# EAGLE design WindPower_HAT_E (EAGLE 9.5.0)
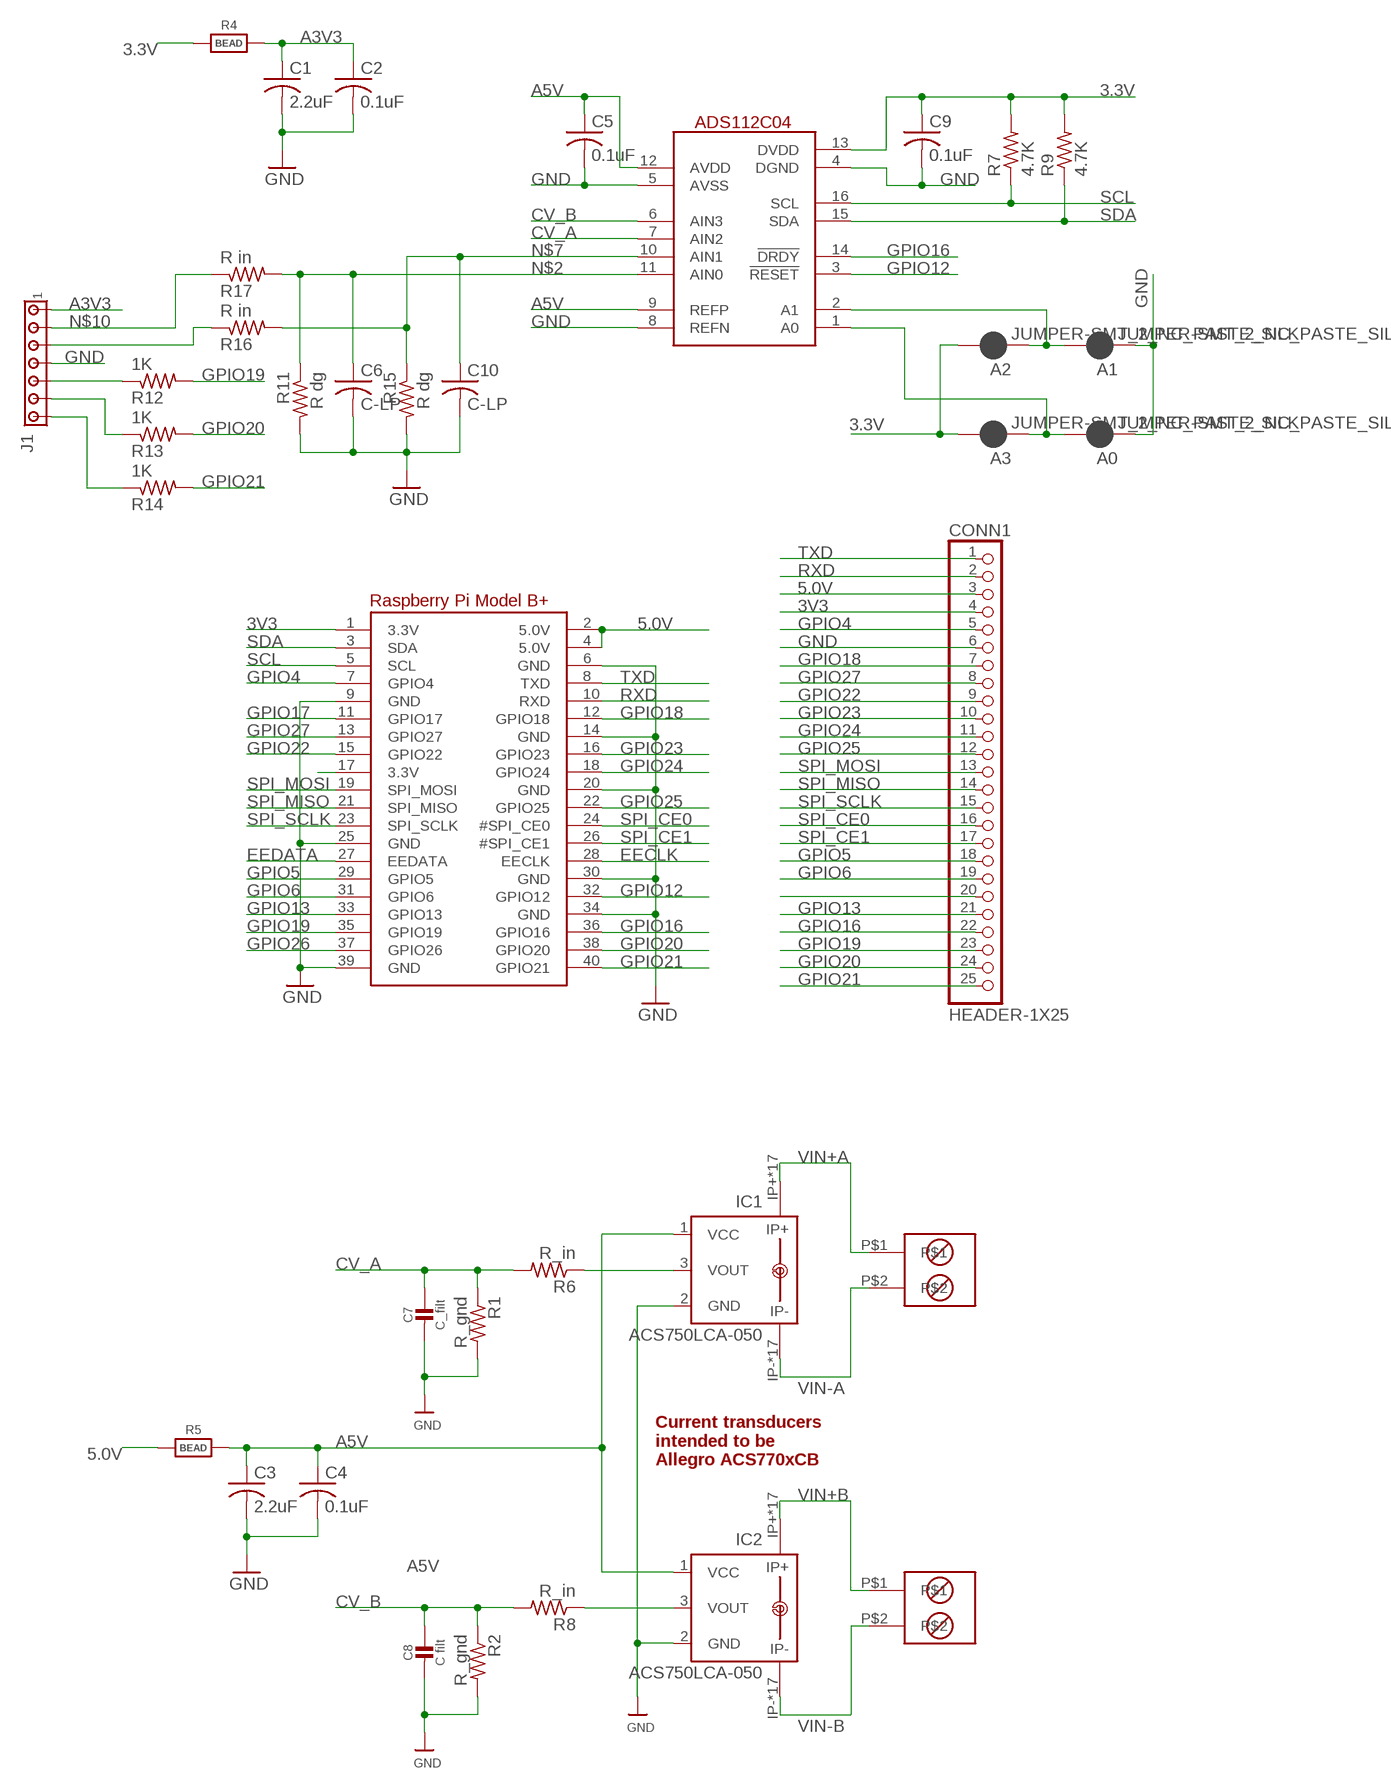
[diagram p0: schematic, sheet 1]

## Parts
A0  JUMPER-SMT_2_NC_PASTE_SILK  [SMT-JUMPER_2_NC_PASTE_SILK]
A1  JUMPER-SMT_2_NC_PASTE_SILK  [SMT-JUMPER_2_NC_PASTE_SILK]
A2  JUMPER-SMT_2_NC_PASTE_SILK  [SMT-JUMPER_2_NC_PASTE_SILK]
A3  JUMPER-SMT_2_NC_PASTE_SILK  [SMT-JUMPER_2_NC_PASTE_SILK]
ADS112C04  ADS112C04TSSOP_FOR_TI_ADC  [SOP65P640X120-16N]
C1  2.2uF  C-USC0805  [C0805]
C2  0.1uF  C-USC0805  [C0805]
C3  2.2uF  C-USC0805  [C0805]
C4  0.1uF  C-USC0805  [C0805]
C5  0.1uF  C-USC0805  [C0805]
C6  C-LP  C-USC0805  [C0805]
C7  C_filt  CAP_CERAMIC0805-NOOUTLINE  [0805-NO@1]
C8  C filt  CAP_CERAMIC0805-NOOUTLINE  [0805-NO@1]
C9  0.1uF  C-USC0805  [C0805]
C10  C-LP  C-USC0805  [C0805]
CONN1  HEADER-1X25  [1X25_ROUND_70MIL]
IC1  ACS750LCA-050  [ACS75050]
IC2  ACS750LCA-050  [ACS75050]
J1  MTA07-100  [10X07MTA]
R1  R_gnd  R-US_R0805  [R0805]
R2  R_gnd  R-US_R0805  [R0805]
R4  BEAD  RESISTOR0805_NOOUTLINE  [0805-NO]
R5  BEAD  RESISTOR0805_NOOUTLINE  [0805-NO]
R6  R_in  R-US_R0805  [R0805]
R7  4.7K  R-US_R0805  [R0805]
R8  R_in  R-US_R0805  [R0805]
R9  4.7K  R-US_R0805  [R0805]
R11  R dg  R-US_R0805  [R0805]
R12  1K  R-US_R0805  [R0805]
R13  1K  R-US_R0805  [R0805]
R14  1K  R-US_R0805  [R0805]
R15  R dg  R-US_R0805  [R0805]
R16  R in  R-US_R0805  [R0805]
R17  R in  R-US_R0805  [R0805]
RPI1  RASPBERRYPI_BPLUS_HATNOSLOTS  [PI_HAT_NOSLOTS]
U$4  SCREW-2-6.35MM  [SCREWY-2-6.35MM]
U$5  SCREW-2-6.35MM  [SCREWY-2-6.35MM]

## Nets
3.3V: A2.2 A3.2 ADS112C04.13(DVDD) C9.1 R4.1 R7.2 R9.2 RPI1.17(3.3V)
3V3: CONN1.4 RPI1.1(3.3V)
5.0V: CONN1.3 R5.1 RPI1.2(5.0V) RPI1.4(5.0V)
A3V3: C1.1 C2.1 J1.1 R4.2
A5V: ADS112C04.9(REFP) ADS112C04.12(AVDD) C3.1 C4.1 C5.1 IC1.1(VCC) IC2.1(VCC) R5.2
CV_A: ADS112C04.7(AIN2) C7.1 R1.1 R6.2
CV_B: ADS112C04.6(AIN3) C8.1 R2.1 R8.2
EECLK: RPI1.28(EECLK)
EEDATA: RPI1.27(EEDATA)
GND: A0.1 A1.1 ADS112C04.4(DGND) ADS112C04.5(AVSS) ADS112C04.8(REFN) C1.2 C2.2 C3.2 C4.2 C5.2 C6.2 C7.2 C8.2 C9.2 C10.2 CONN1.6 CONN1.20 IC1.2(GND) IC2.2(GND) J1.4 R1.2 R2.2 R11.2 R15.2 RPI1.6(GND) RPI1.9(GND) RPI1.14(GND) RPI1.20(GND) RPI1.25(GND) RPI1.30(GND) RPI1.34(GND) RPI1.39(GND)
GPIO4: CONN1.5 RPI1.7(GPIO4)
GPIO5: CONN1.18 RPI1.29(GPIO5)
GPIO6: CONN1.19 RPI1.31(GPIO6)
GPIO12: ADS112C04.3(!RESET) RPI1.32(GPIO12)
GPIO13: CONN1.21 RPI1.33(GPIO13)
GPIO16: ADS112C04.14(!DRDY) CONN1.22 RPI1.36(GPIO16)
GPIO17: RPI1.11(GPIO17)
GPIO18: CONN1.7 RPI1.12(GPIO18)
GPIO19: CONN1.23 R12.2 RPI1.35(GPIO19)
GPIO20: CONN1.24 R13.2 RPI1.38(GPIO20)
GPIO21: CONN1.25 R14.2 RPI1.40(GPIO21)
GPIO22: CONN1.9 RPI1.15(GPIO22)
GPIO23: CONN1.10 RPI1.16(GPIO23)
GPIO24: CONN1.11 RPI1.18(GPIO24)
GPIO25: CONN1.12 RPI1.22(GPIO25)
GPIO26: RPI1.37(GPIO26)
GPIO27: CONN1.8 RPI1.13(GPIO27)
N$1: IC1.3(VOUT) R6.1
N$2: ADS112C04.11(AIN0) C6.1 R11.1 R17.2
N$3: IC2.3(VOUT) R8.1
N$4: J1.5 R12.1
N$5: J1.6 R13.1
N$6: J1.7 R14.1
N$7: ADS112C04.10(AIN1) C10.1 R15.1 R16.2
N$8: A1.2 A2.1 ADS112C04.2(A1)
N$9: A0.2 A3.1 ADS112C04.1(A0)
N$10: J1.2 R17.1
N$11: J1.3 R16.1
RXD: CONN1.2 RPI1.10(RXD)
SCL: ADS112C04.16(SCL) R7.1 RPI1.5(SCL)
SDA: ADS112C04.15(SDA) R9.1 RPI1.3(SDA)
SPI_CE0: CONN1.16 RPI1.24(#SPI_CE0)
SPI_CE1: CONN1.17 RPI1.26(#SPI_CE1)
SPI_MISO: CONN1.14 RPI1.21(SPI_MISO)
SPI_MOSI: CONN1.13 RPI1.19(SPI_MOSI)
SPI_SCLK: CONN1.15 RPI1.23(SPI_SCLK)
TXD: CONN1.1 RPI1.8(TXD)
VIN+A: IC1.IP+ IC1.IP+@2(IP+) IC1.IP+@3(IP+) IC1.IP+@4(IP+) IC1.IP+@5(IP+) IC1.IP+@6(IP+) IC1.IP+@7(IP+) IC1.IP+@8(IP+) IC1.IP+@9(IP+) IC1.IP+@10(IP+) IC1.IP+@11(IP+) IC1.IP+@12(IP+) IC1.IP+@13(IP+) IC1.IP+@14(IP+) IC1.IP+@15(IP+) IC1.IP+@16(IP+) IC1.IP+@17(IP+) U$4.P$1
VIN+B: IC2.IP+ IC2.IP+@2(IP+) IC2.IP+@3(IP+) IC2.IP+@4(IP+) IC2.IP+@5(IP+) IC2.IP+@6(IP+) IC2.IP+@7(IP+) IC2.IP+@8(IP+) IC2.IP+@9(IP+) IC2.IP+@10(IP+) IC2.IP+@11(IP+) IC2.IP+@12(IP+) IC2.IP+@13(IP+) IC2.IP+@14(IP+) IC2.IP+@15(IP+) IC2.IP+@16(IP+) IC2.IP+@17(IP+) U$5.P$1
VIN-A: IC1.IP- IC1.IP-@2(IP-) IC1.IP-@3(IP-) IC1.IP-@4(IP-) IC1.IP-@5(IP-) IC1.IP-@6(IP-) IC1.IP-@7(IP-) IC1.IP-@8(IP-) IC1.IP-@9(IP-) IC1.IP-@10(IP-) IC1.IP-@11(IP-) IC1.IP-@12(IP-) IC1.IP-@13(IP-) IC1.IP-@14(IP-) IC1.IP-@15(IP-) IC1.IP-@16(IP-) IC1.IP-@17(IP-) U$4.P$2
VIN-B: IC2.IP- IC2.IP-@2(IP-) IC2.IP-@3(IP-) IC2.IP-@4(IP-) IC2.IP-@5(IP-) IC2.IP-@6(IP-) IC2.IP-@7(IP-) IC2.IP-@8(IP-) IC2.IP-@9(IP-) IC2.IP-@10(IP-) IC2.IP-@11(IP-) IC2.IP-@12(IP-) IC2.IP-@13(IP-) IC2.IP-@14(IP-) IC2.IP-@15(IP-) IC2.IP-@16(IP-) IC2.IP-@17(IP-) U$5.P$2

## Notes on the sheet
- Current transducers
  intended to be 
  Allegro ACS770xCB

## Library data of the parts
A0 A1-A3 = SparkFun-Jumpers:JUMPER-SMT_2_NC_PASTE: Normally closed solder jumper This jumper has an aperture in the stencil to allow solder paste to bridge the split in the wire so it's normally closed (NC). Wick off the solder to open the connection. Reapply solder to reclose the connection.
ADS112C04 = TI-mechatronics:ADS112C04: 4-channel, 16-bit, 2000 sample/sec delta-sigma ADC with I2C interface
C1-C6 C9 C10 = rcl:C-US: CAPACITOR, American symbol; SPICEPREFIX: C
C7 C8 = microbuilder:CAP_CERAMIC: Ceramic Capacitors For new designs, use the packages preceded by an '_' character since they are more reliable: The following footprints should be used on most boards: _0402 - Standard footprint for regular board layouts _0603 - Standard footprint for regular board layouts _0805 - Standard footprint for regular board layouts _1206 - Standard footprint for regular board layouts For extremely tight-pitch boards where space is at a premium, the following 'micro-pitch' footprints can be used (smaller pads, no silkscreen outline, etc.): _0402MP - Micro-pitch footprint for very dense/compact boards _0603MP - Micro-pitch footprint for very dense/compact boards _0805MP - Micro-pitch footprint for very dense/compact boards _1206MP - Micro-pitch footprint for very dense/compact boards
CONN1 = microbuilder:HEADER-1X25
IC1 IC2 = allegro:ACS750*CA-050: Current Sensor display layer 49 Reference in BRD and place VIAs on circles Source: www.allegromicro.com/datafile/0750-050.pdf; MF: ALLEGRO MICROSYSTEMS, INC.; MPN: ACS750LCA-050; OC_FARNELL: 1457176; OC_NEWARK: 61H4464
J1 = con-amp:MTA07-100: AMP connector
R1 R2 R6-R9 R11-R17 = rcl:R-US_: RESISTOR, American symbol; SPICEPREFIX: R
R4 R5 = microbuilder:RESISTOR: Resistors For new designs, use the packages preceded by an '_' character since they are more reliable: The following footprints should be used on most boards: _0402 - Standard footprint for regular board layouts _0603 - Standard footprint for regular board layouts _0805 - Standard footprint for regular board layouts _1206 - Standard footprint for regular board layouts For extremely tight-pitch boards where space is at a premium, the following 'micro-pitch' footprints can be used (smaller pads, no silkscreen outline, etc.): _0402MP - Micro-pitch footprint for very dense/compact boards _0603MP - Micro-pitch footprint for very dense/compact boards _0805MP - Micro-pitch footprint for very dense/compact boards _1206MP - Micro-pitch footprint for very dense/compact boards
RPI1 = microbuilder:RASPBERRYPI_BPLUS
U$4 U$5 = TI-mechatronics:SCREW-2-6.35MM: Screw terminal with 0.25" (6.35mm) pitch.

## Board
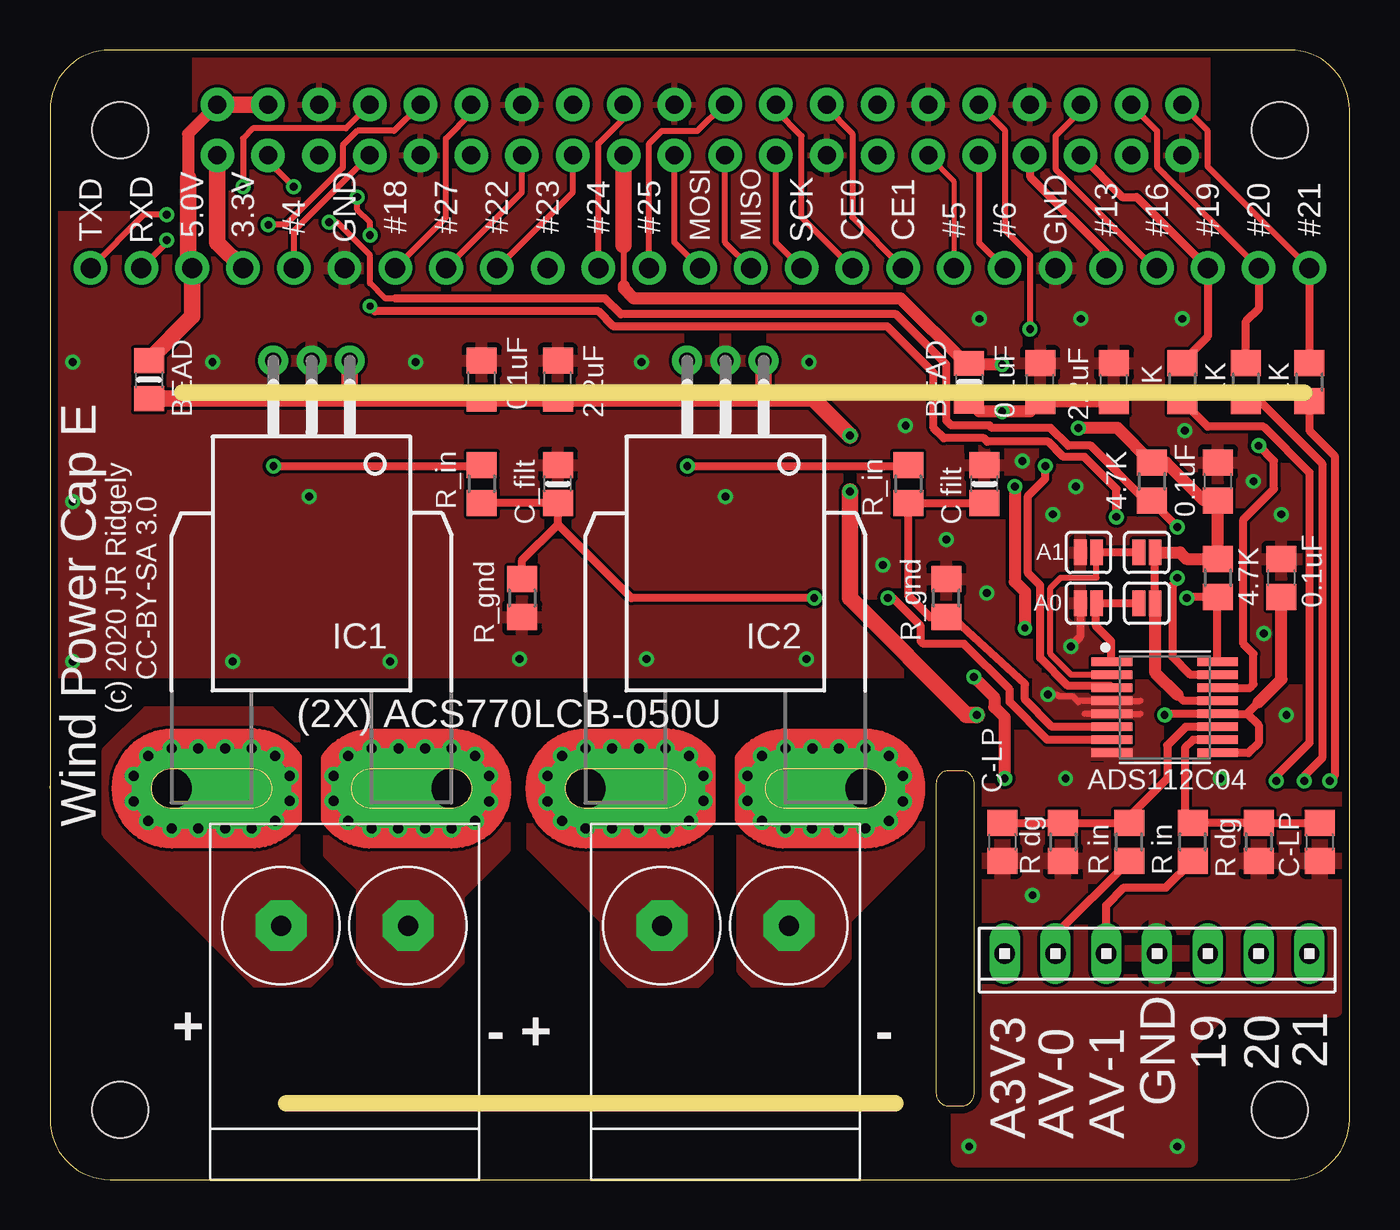
[diagram p1: board, top side]
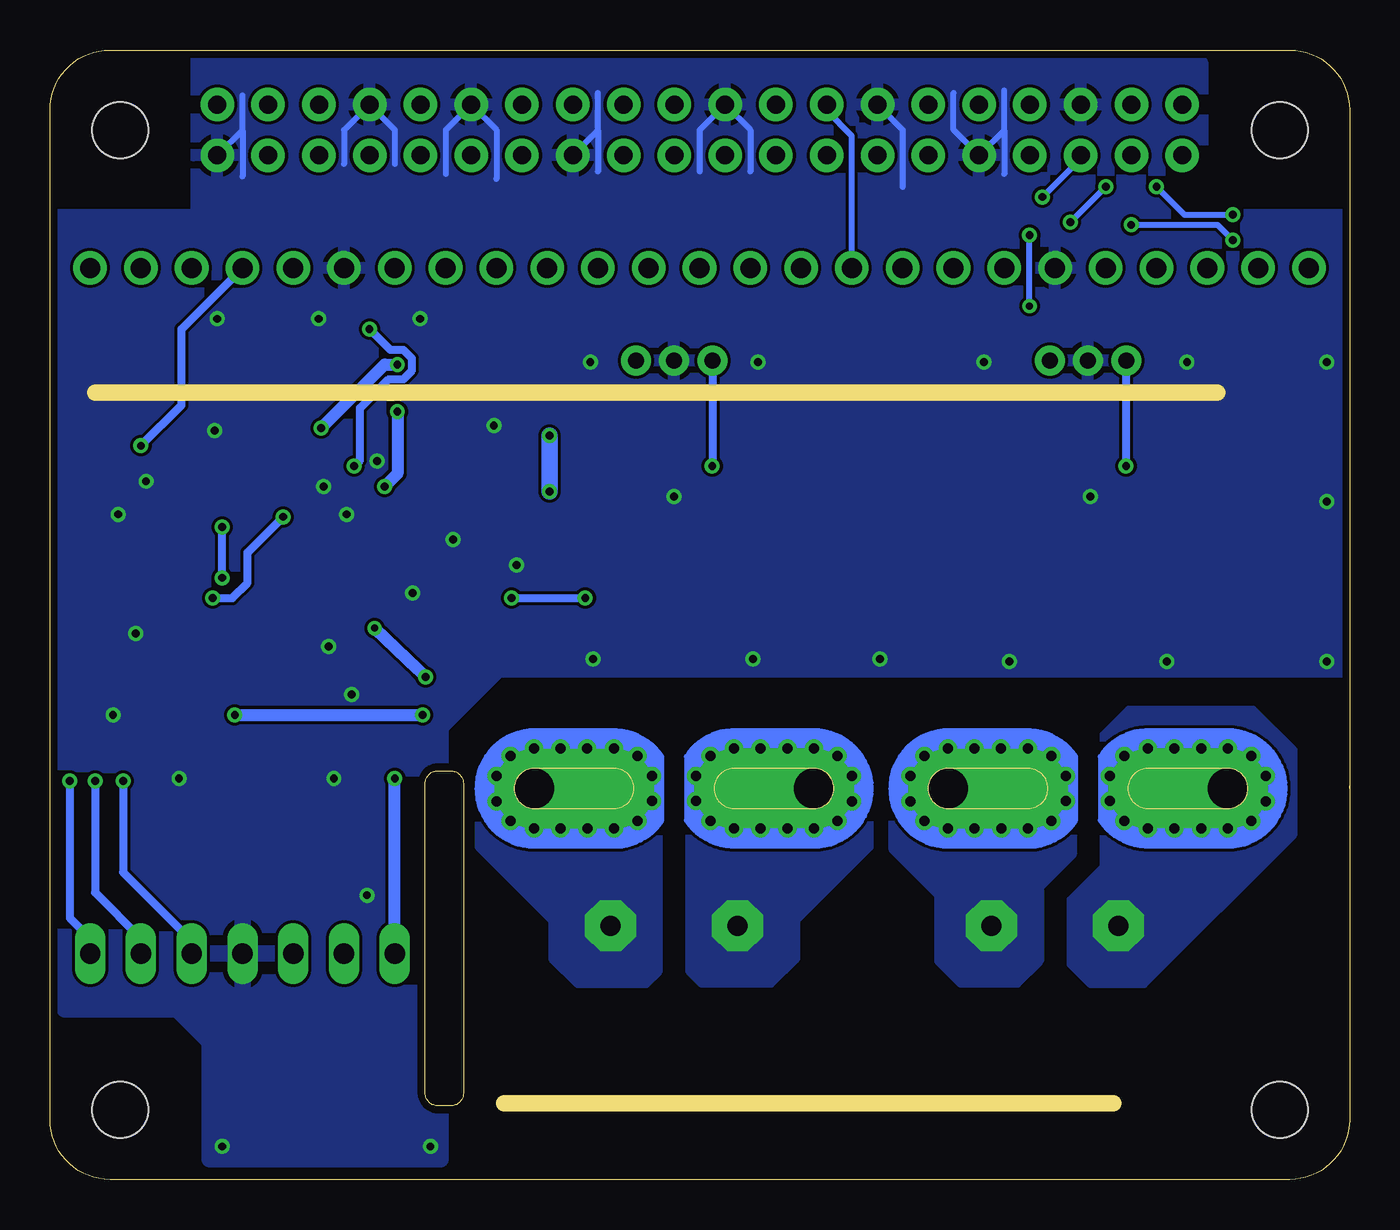
[diagram p2: board, bottom side, seen from below]

Size 65 x 56.5 mm. Coordinates in mm from the lower left corner, seen from the top.
Outline: 0,19.56 0,19.68
Outline: 44.96,3.68 45.59,3.68 arc90 46.23,4.32 46.23,19.81 arc90 45.59,20.45 44.96,20.45 arc90 44.32,19.81 44.32,4.32 arc90 44.96,3.68
Copper layers (1*16): Top 0.0356mm / dielectric 1.5011mm / Bottom 0.0356mm
Design rules "LaenPCBOrder *": minimum track width 6mil, minimum drill 13mil, track to track 6mil, track to pad 6mil, pad to pad 6mil, via to via 6mil, smd to smd 6mil, copper to edge 15mil, drill to drill 6mil, minimum pad ring 7mil, minimum via ring 7mil, stop-mask expansion 4mil, vias tented up to drill 18mil, thermal gap 10mil
Milling: 2 lines

### Footprints (pad centres in the part's own frame; a part is rotated, then mirrored left to right if it is on the bottom)
SMT-JUMPER_2_NC_PASTE_SILK = smd 0.635 x 1.27: 1 -0.406,0; 2 0.406,0
SOP65P640X120-16N = smd 2.031 x 0.407: 1 -2.642,2.275; 2 -2.642,1.625; 3 -2.642,0.975; 4 -2.642,0.325; 5 -2.642,-0.325; 6 -2.642,-0.975; 7 -2.642,-1.625; 8 -2.642,-2.275; 9 2.642,-2.275; 10 2.642,-1.625; 11 2.642,-0.975; 12 2.642,-0.325; 13 2.642,0.325; 14 2.642,0.975; 15 2.642,1.625; 16 2.642,2.275
C0805 = smd 1.3 x 1.5: 1 -0.95,0; 2 0.95,0
0805-NO@1 = smd 1.3 x 1.5: 1 -0.95,0; 2 0.95,0
1X25_ROUND_70MIL = drill 1 pad 1.676: 1 -30.48,0; 2 -27.94,0; 3 -25.4,0; 4 -22.86,0; 5 -20.32,0; 6 -17.78,0; 7 -15.24,0; 8 -12.7,0; 9 -10.16,0; 10 -7.62,0; 11 -5.08,0; 12 -2.54,0; 13 0,0; 14 2.54,0; 15 5.08,0; 16 7.62,0; 17 10.16,0; 18 12.7,0; 19 15.24,0; 20 17.78,0; 21 20.32,0; 22 22.86,0; 23 25.4,0; 24 27.94,0; 25 30.48,0
ACS75050 = drill 0.8 pad 1.5: 1 -1.91,-21.4; 2 0,-21.4; 3 1.91,-21.4 | drill 2 pad 4 offset: IP+ 7,0; IP- -7,0 | drill 0.5 pad 0.9: IP+@2 8.89,-0.635; IP+@3 8.89,0.635; IP+@4 8.175,1.625; IP+@5 7,2; IP+@6 5.675,2; IP+@7 4.325,2; IP+@8 3,2; IP+@9 1.825,1.625; IP+@10 1.1,0.625; IP+@11 1.1,-0.625; IP+@12 1.825,-1.625; IP+@13 3,-2; IP+@14 4.325,-2; IP+@15 5.675,-2; IP+@16 7,-2; IP+@17 8.175,-1.625; IP-@2 -8.89,-0.635; IP-@3 -8.89,0.635; IP-@4 -8.175,1.625; IP-@5 -7,2; IP-@6 -5.675,2; IP-@7 -4.325,2; IP-@8 -3,2; IP-@9 -1.825,1.625; IP-@10 -1.1,0.625; IP-@11 -1.1,-0.625; IP-@12 -1.825,-1.625; IP-@13 -3,-2; IP-@14 -4.35,-2; IP-@15 -5.675,-2; IP-@16 -7,-2; IP-@17 -8.175,-1.625
10X07MTA = drill 1.016 long: 1 7.62,0; 2 5.08,0; 3 2.54,0; 4 0,0; 5 -2.54,0; 6 -5.08,0; 7 -7.62,0
R0805 = smd 1.3 x 1.5: 1 -0.95,0; 2 0.95,0
0805-NO = smd 1.24 x 1.5: 1 -0.95,0; 2 0.95,0
PI_HAT_NOSLOTS = drill 0.9 pad 1.676: 1 8.37,51.23; 2 8.37,53.77; 3 10.91,51.23; 4 10.91,53.77; 5 13.45,51.23; 6 13.45,53.77; 7 15.99,51.23; 8 15.99,53.77; 9 18.53,51.23; 10 18.53,53.77; 11 21.07,51.23; 12 21.07,53.77; 13 23.61,51.23; 14 23.61,53.77; 15 26.15,51.23; 16 26.15,53.77; 17 28.69,51.23; 18 28.69,53.77; 19 31.23,51.23; 20 31.23,53.77; 21 33.77,51.23; 22 33.77,53.77; 23 36.31,51.23; 24 36.31,53.77; 25 38.85,51.23; 26 38.85,53.77; 27 41.39,51.23; 28 41.39,53.77; 29 43.93,51.23; 30 43.93,53.77; 31 46.47,51.23; 32 46.47,53.77; 33 49.01,51.23; 34 49.01,53.77; 35 51.55,51.23; 36 51.55,53.77; 37 54.09,51.23; 38 54.09,53.77; 39 56.63,51.23; 40 56.63,53.77 | hole 2.8: 3.5,3.5; 3.5,52.5; 61.5,52.5; 61.5,3.5
SCREWY-2-6.35MM = drill 1 pad 2.54 octagon: P$1 -3.175,0; P$2 3.175,0

### Placement (x,y rotation side)
A0  51.94,28.83 0 top
A1  51.94,31.37 0 top
A2  54.86,31.37 0 top
A3  54.86,28.83 0 top
ADS112C04  55.75,23.62 0 top
C1  53.21,39.88 90 top
C2  49.53,39.88 90 top
C3  25.4,40.01 90 top
C4  21.59,40.01 90 top
C5  61.59,30.1 90 top
C6  47.62,16.89 270 top
C7  25.4,34.8 90 top
C8  46.74,34.8 90 top
C9  58.42,34.92 90 top
C10  63.5,16.89 270 top
CONN1  32.51,45.59 0 top
IC1  13.08,19.56 180 top
IC2  33.78,19.56 180 top
J1  55.37,11.3 180 top
R1  23.62,29.08 270 top
R2  44.83,29.08 90 top
R4  45.97,39.88 270 top
R5  4.95,40.01 270 top
R6  21.59,34.8 270 top
R7  58.42,30.1 90 top
R8  42.93,34.8 270 top
R9  55.12,34.92 90 top
R11  50.67,16.89 270 top
R12  56.64,39.88 90 top
R13  59.82,39.88 90 top
R14  62.99,39.88 90 top
R15  60.45,16.89 270 top
R16  57.15,16.89 90 top
R17  53.98,16.89 90 top
RPI1  0,0 0 top
U$4  14.73,12.7 0 top
U$5  33.78,12.7 0 top

### Tracks (layer width: path | path; a pad name or v marks a point on that pad's centre or on a via)
3.3V  (via drill 0.39)
  Top 0.305: 28.7,44.7 28.7,46.74 28.69,46.75
  Top 0.406: ADS112C04.13 56.7,23.95 56.39,24.26 | A3.2 A2.2
  Top 0.61: A3.2 55.27,25.38 56.39,24.26 | A2.2 56.52,31.37 56.84,31.05 R7.2 C9.1 57.72,33.98 55.82,35.88 R9.2 53.4,37.59 v51.44,37.59 | v47.62,40.77 46.03,40.77 R4.1 45.79,40.83 42.55,44.07 29.21,44.07 28.7,44.58 28.7,44.7
  Top 0.813: RPI1.17 28.69,46.75
  Bottom 0.61: v51.44,37.59 48.26,40.77 v47.62,40.77
3V3
  Top 0.813: RPI1.1 8.37,46.88 CONN1.4
5.0V
  Top 0.61: RPI1.2 6.91,52.3 6.91,50.12
  Top 0.813: RPI1.2 RPI1.4 | 6.91,50.12 6.91,45.8 CONN1.3 7.11,43.18 4.95,41.02 R5.1
A3V3  (via drill 0.35, 0.39)
  Top 0.61: R4.2 46.48,38.42 v47.62,38.42 49.02,38.42 C2.1 C1.1 | v47.75,20.07 47.75,23.11 47.24,23.63 47.24,24.12 v46.22,25.14 | v48.77,27.58 48.77,29.4 48.26,29.91 v48.26,34.67
  Bottom 0.61: J1.1 v47.75,20.07 | v48.26,34.67 47.62,35.31 v47.62,38.42 | v46.22,25.14 46.6,25.54 v48.77,27.58
A5V  (via drill 0.39)
  Top 0.406: 59.89,23.3 ADS112C04.12 55.81,23.3 v55.75,23.24 | 59.89,23.3 60.45,22.73 60.45,21.84 59.94,21.34 58.41,21.34 ADS112C04.9 | 59.89,23.3 59.89,23.31 60.45,23.88
  Top 0.61: 60.45,23.88 61.59,25.02 C5.1
  Top 0.813: 35.69,39.05 C3.1 C4.1 14.99,39.05 | 35.69,39.05 IC2.1 | R5.2 14.99,39.05 | IC1.1 14.99,39.06 14.99,39.05 | 35.69,39.05 38.16,39.05 v40.01,37.21 | v46.35,23.24 45.85,23.24 40.01,29.08 v40.01,34.42
  Bottom 0.61: v55.75,23.24 v46.35,23.24
  Bottom 0.813: v40.01,37.21 v40.01,34.42
CV_A  (via drill 0.39)
  Top 0.406: R6.2 21.59,33.88 R6.2 C7.1 25.4,32.77 | R1.1 23.62,30.99 25.4,32.77 | ADS112C04.7 49.88,22 48.01,23.88 48.01,24.51 45.72,26.8 43.69,26.8 43.56,26.92 43.56,27.69 42.16,29.08 v41.91,29.08 | 25.4,32.77 29.08,29.08 v38.23,29.08
  Bottom 0.406: v41.91,29.08 v38.23,29.08
CV_B
  Top 0.406: ADS112C04.6 50.12,22.65 48.77,24 48.77,24.78 45.32,27.94 44.83,27.94 R2.1 44,28.13 42.93,29.21 R8.2 C8.1
GND  (via drill 0.39)
  Top 0.305: 54.55,23.3 ADS112C04.5 51.76,23.3 | 54.54,23.95 ADS112C04.4 51.51,23.95 51.44,23.88 51.13,24.18 50.46,24.18 50.38,24.26 v49.91,24.26
  Top 0.406: A0.1 51.54,27.15 v51.05,26.67
  Bottom 0.305: 29.97,50.42 29.97,52.51 RPI1.20 32.51,52.49 32.51,50.42 | RPI1.25 37.59,52.49 | 37.59,52.49 37.59,54.36 | 45.21,50.29 45.21,52.49 RPI1.30 42.67,52.51 42.67,50.04 | 47.75,50.8 47.75,52.51 RPI1.34 50.29,52.49 50.29,50.8 | RPI1.39 55.37,52.49 | 55.37,52.49 55.37,54.23 | 55.37,52.49 55.37,50.16 | 37.59,52.49 37.59,50.42 | RPI1.14 22.35,52.51 22.35,49.66 | 17.27,52.49 RPI1.9 19.81,52.51 19.81,54.36 | 17.27,52.49 17.27,54.48 | 17.27,52.49 17.27,50.29
  other vias: 41.66,30.73 51.56,43.05 23.5,26.04 50.8,20.07 58.55,20.07 29.84,26.04 17.02,25.91 1.14,33.91 1.14,40.89 1.14,25.91 61.85,23.24 37.85,26.04 9.14,25.91 49.15,14.22 61.59,33.27 44.83,32 33.78,34.16 12.95,34.16 60.71,27.3 56.77,37.47 48.64,35.94 46.86,29.34 51.31,34.67 42.8,37.72 56.64,43.05 46.48,43.05 60.2,34.92 45.97,1.65 56.39,1.65 50.16,33.27 37.97,40.89 29.59,40.89 18.29,40.89 8.13,40.89
  pour Bottom (rank 5): 7.37,55.88 7.37,48.26 0.38,48.26 0.38,25.4 64.77,25.4 64.77,48.26 57.66,48.26 57.66,56.13 7.62,56.13
  pour Top (rank 6): 64.77,48.13 0.38,48.13 0.38,25.4 64.77,25.4
  pour Top: 7.24,56.26 7.24,43.94 57.91,43.94 57.91,56.26
  pour Top: 64.26,25.53 64.26,8.51 58.67,8.51 57.02,6.86 57.02,1.02 45.47,1.02 45.47,22.61 42.42,25.65 64.14,25.65
  pour Bottom: 64.26,25.53 64.26,8.51 58.67,8.51 57.02,6.86 57.02,1.02 45.47,1.02 45.47,22.61 42.29,25.78 64.01,25.78
GPIO4
  Top 0.305: RPI1.7 12.19,47.43 CONN1.5
GPIO5
  Top 0.254: RPI1.29 45.21,49.95 CONN1.18
GPIO6
  Top 0.305: RPI1.31 46.47,46.88 CONN1.19
GPIO12  (via drill 0.39)
  Top 0.305: RPI1.32 47.75,52.49 47.75,47.5 49.02,46.23 v49.02,42.55
  Top 0.406: ADS112C04.3 53.02,24.69 50.92,24.69 49.53,26.08 49.53,29.72 48.92,30.33 48.92,34.19 49.78,35.05 v49.78,35.69
  Bottom 0.406: v49.78,35.69 49.5,35.97 49.5,38.59 48.06,40.04 47.32,40.04 46.9,40.47 46.9,41.07 47.32,41.5 47.97,41.5 v49.02,42.55
GPIO13
  Top 0.406: RPI1.33 49.02,51.22 49.02,50.16 52.83,46.35 CONN1.21
GPIO16  (via drill 0.39)
  Top 0.305: RPI1.36 51.55,53.45 50.29,52.2 50.29,50.55 55.24,45.59 CONN1.22
  Top 0.406: ADS112C04.14 60.03,24.6 60.2,24.77 60.2,26.29 59.69,26.8 59.69,33.02 61.21,34.54 61.21,35.94 v60.45,36.7
  Bottom 0.406: v60.45,36.7 58.42,38.73 58.42,42.55 CONN1.22
GPIO18
  Top 0.305: CONN1.7 19.81,48.13 19.81,52.07 21.07,53.33 RPI1.12
GPIO19
  Top 0.406: R12.2 56.64,40.89 57.91,42.16 CONN1.23 54.36,49.15 53.63,49.15 RPI1.35
GPIO20
  Top 0.305: RPI1.38 54.09,53.73 55.37,52.45 55.37,50.67 CONN1.24
  Top 0.406: R13.2 59.82,42.93 60.45,43.56 CONN1.24
GPIO21
  Top 0.305: CONN1.25 57.91,50.67 57.91,52.45 57.15,53.21 56.68,53.72 RPI1.40
  Top 0.406: CONN1.25 R14.2
GPIO22
  Top 0.305: CONN1.9 26.15,49.39 RPI1.15
GPIO23
  Bottom 0.305: CONN1.10 24.89,52.2 26.15,53.45 RPI1.16
GPIO24
  Top 0.305: CONN1.11 27.43,51.82 28.69,53.07 RPI1.18
GPIO25
  Top 0.305: CONN1.12 29.97,51.82 30.61,52.45 32.38,52.45 33.7,53.77 RPI1.22
GPIO27
  Top 0.305: CONN1.8 23.61,49.39 RPI1.13
N$1  (via drill 0.39)
  Top 0.406: v11.18,35.69 21.53,35.69 R6.1
  Bottom 0.406: IC1.3 v11.18,35.69
N$2
  Top 0.406: ADS112C04.11 56.81,22.65 55.88,21.72 55.88,20.07 53.98,18.16 R17.2 R11.1 C6.1
N$3  (via drill 0.39)
  Top 0.406: v31.88,35.69 42.87,35.69 R8.1
  Bottom 0.406: IC2.3 v31.87,35.69 v31.88,35.69
N$4  (via drill 0.39)
  Top 0.406: R12.1 57.91,37.66 60.71,37.66 62.99,35.37 62.99,21.84 61.34,20.19 v61.34,19.94
  Bottom 0.406: v61.34,19.94 61.34,15.37 57.91,11.94 J1.5
N$5  (via drill 0.39)
  Top 0.406: R13.1 60.51,38.93 63.63,35.81 63.63,21.08 62.74,20.19 v62.74,19.94
  Bottom 0.406: v62.74,19.94 62.74,14.35 60.45,12.06 J1.6
N$6  (via drill 0.39)
  Top 0.406: R14.1 62.99,37.47 64.26,36.2 64.26,20.19 v64.01,19.94
  Bottom 0.406: v64.01,19.94 64.01,13.08 62.99,12.06 J1.7
N$7
  Top 0.406: ADS112C04.10 57.18,22 56.77,21.59 56.77,18.09 57.02,17.84 R16.2 R15.1 C10.1
N$8
  Top 0.305: ADS112C04.2 51.08,25.25 50.04,26.29 50.04,29.59 50.55,30.1 52.35,30.1 A1.2
  Top 0.406: A2.1 A1.2
N$9
  Top 0.406: A3.1 A0.2 52.32,28.8 52.32,27.69 53.09,26.92 53.09,25.92 ADS112C04.1
N$10
  Top 0.406: J1.2 50.29,12.26 R17.1
N$11
  Top 0.406: J1.3 52.83,13.72 53.72,14.61 55.81,14.61 R16.1
RXD  (via drill 0.39)
  Top 0.305: RPI1.10 17.21,52.45 15.37,52.45 14.64,51.73 14.64,50.6 11.79,47.75 v10.92,47.75 | v5.84,46.99 5.84,46.86 CONN1.2
  Bottom 0.305: v5.84,46.99 6.6,47.75 v10.92,47.75
SCL  (via drill 0.35, 0.39)
  Top 0.305: v16,47.24 16,47.88 15.37,48.51 v15.37,49.15
  Top 0.406: ADS112C04.16 58.4,29.12 R7.1 56.93,29.15 v56.86,29.08 | v53.34,33.15 53.34,34.54 51.74,36.14 50.7,36.14 49.93,36.91 46.89,36.91 46.72,37.08 44.7,37.08 44.2,37.59 44.2,40.36 41.88,42.67 28.19,42.67 27.43,43.43 16.26,43.43 v16,43.69
  Bottom 0.305: RPI1.5 13.45,51.07 v15.37,49.15 | v16,43.69 v16,47.24
  Bottom 0.406: v56.86,29.08 55.88,29.08 55.12,29.84 55.12,31.37 v53.34,33.15
SDA  (via drill 0.39)
  Top 0.305: 17.27,44.07 16.76,44.07 16,44.83 16,46.23 14.35,47.88 v13.97,47.88 | RPI1.3 10.91,50.94 v12.19,49.66 | R9.1 55.12,33.91
  Top 0.406: ADS112C04.15 57.05,25.25 56.13,26.16 56.13,29.72 56.39,29.97 v56.39,30.1 | 55.12,33.91 v56.39,32.64 | R9.1 54.8,33.98 52.07,36.7 50.93,36.7 50.04,37.59 47.12,37.59 46.99,37.72 45.09,37.72 44.83,37.97 44.83,40.77 42.32,43.28 28.55,43.28 27.77,44.07 17.27,44.07
  Bottom 0.305: v13.97,47.88 v12.19,49.66
  Bottom 0.406: v56.39,30.1 v56.39,32.64
SPI_CE0
  Top 0.305: CONN1.16 37.59,48.13 37.59,52.2 36.31,53.48 RPI1.24
SPI_CE1
  Top 0.305: RPI1.26 38.85,53.61 40.13,52.32 40.13,48.13 CONN1.17
SPI_MISO
  Top 0.305: CONN1.14 33.77,46.88 RPI1.21
SPI_MOSI
  Top 0.305: CONN1.13 31.23,46.88 RPI1.19
SPI_SCLK
  Top 0.305: CONN1.15 36.31,46.88 RPI1.23
TXD  (via drill 0.39)
  Top 0.305: RPI1.8 14.8,52.58 10.16,52.58 9.65,52.07 v9.65,49.66 | v5.84,48.26 4.7,48.26 CONN1.1
  Bottom 0.305: v9.65,49.66 8.26,48.26 v5.84,48.26
VIN+A
  pour Bottom (no thermals): 12.32,22.23 12.32,15.62 13.97,13.97 13.97,10.79 12.95,9.78 10.29,9.78 2.79,17.27 2.79,21.46 4.83,23.5 11.05,23.5
  pour Top (no thermals): 12.32,22.23 12.32,15.75 13.97,14.1 13.97,10.79 12.95,9.78 10.29,9.78 2.79,17.27 2.79,21.46 4.83,23.5 11.05,23.5
VIN+B
  pour Top (no thermals): 24,22.23 24,16.64 27.69,12.95 27.69,11.05 28.96,9.78 32.38,9.78 33.02,10.41 33.02,22.1 31.5,23.62 25.4,23.62
  pour Bottom (no thermals): 24,22.23 24,16.64 27.69,12.95 27.69,11.05 28.96,9.78 32.38,9.78 33.02,10.41 33.02,22.1 31.5,23.62 25.4,23.62
VIN-A
  pour Bottom (no thermals): 13.84,22.23 13.84,16.26 15.49,14.61 15.49,10.92 16.64,9.78 19.43,9.78 20.57,10.92 20.57,14.22 22.86,16.51 22.86,22.23 21.46,23.62 15.24,23.62
  pour Top (no thermals): 13.84,22.23 13.84,16.26 15.49,14.61 15.49,10.92 16.64,9.78 19.43,9.78 20.57,10.92 20.57,14.22 22.86,16.51 22.86,22.23 21.46,23.62 15.24,23.62
VIN-B
  pour Bottom (no thermals): 43.56,22.1 43.56,16.64 39.88,12.95 39.88,11.05 38.61,9.78 35.18,9.78 34.54,10.41 34.54,22.1 36.07,23.62 42.04,23.62
  pour Top (no thermals): 43.56,22.1 43.56,16.64 39.88,12.95 39.88,11.05 38.61,9.78 35.18,9.78 34.54,10.41 34.54,22.1 36.07,23.62 42.04,23.62

### Text on the board
tPlace: TXD | RXD | 5.0V | 3.3V | GND | #18 | #27 | #22 | #23 | #24 | #25 | MOSI | MISO | SCK | CE0 | CE1 | GND | #13 | #16 | #19 | #20 | #21 | #4 | #5 | #6
tNames: (c) 2020 JR Ridgely / CC-BY-SA 3.0 | (2X) ACS770LCB-050U | Wind Power Cap E | + | - + | - | 21 | 19 | 20 | GND | A3V3 | AV-0 | AV-1
tValues: WP
tSilk: + | + | + | +